# EAGLE design badge (EAGLE 7.4.0)
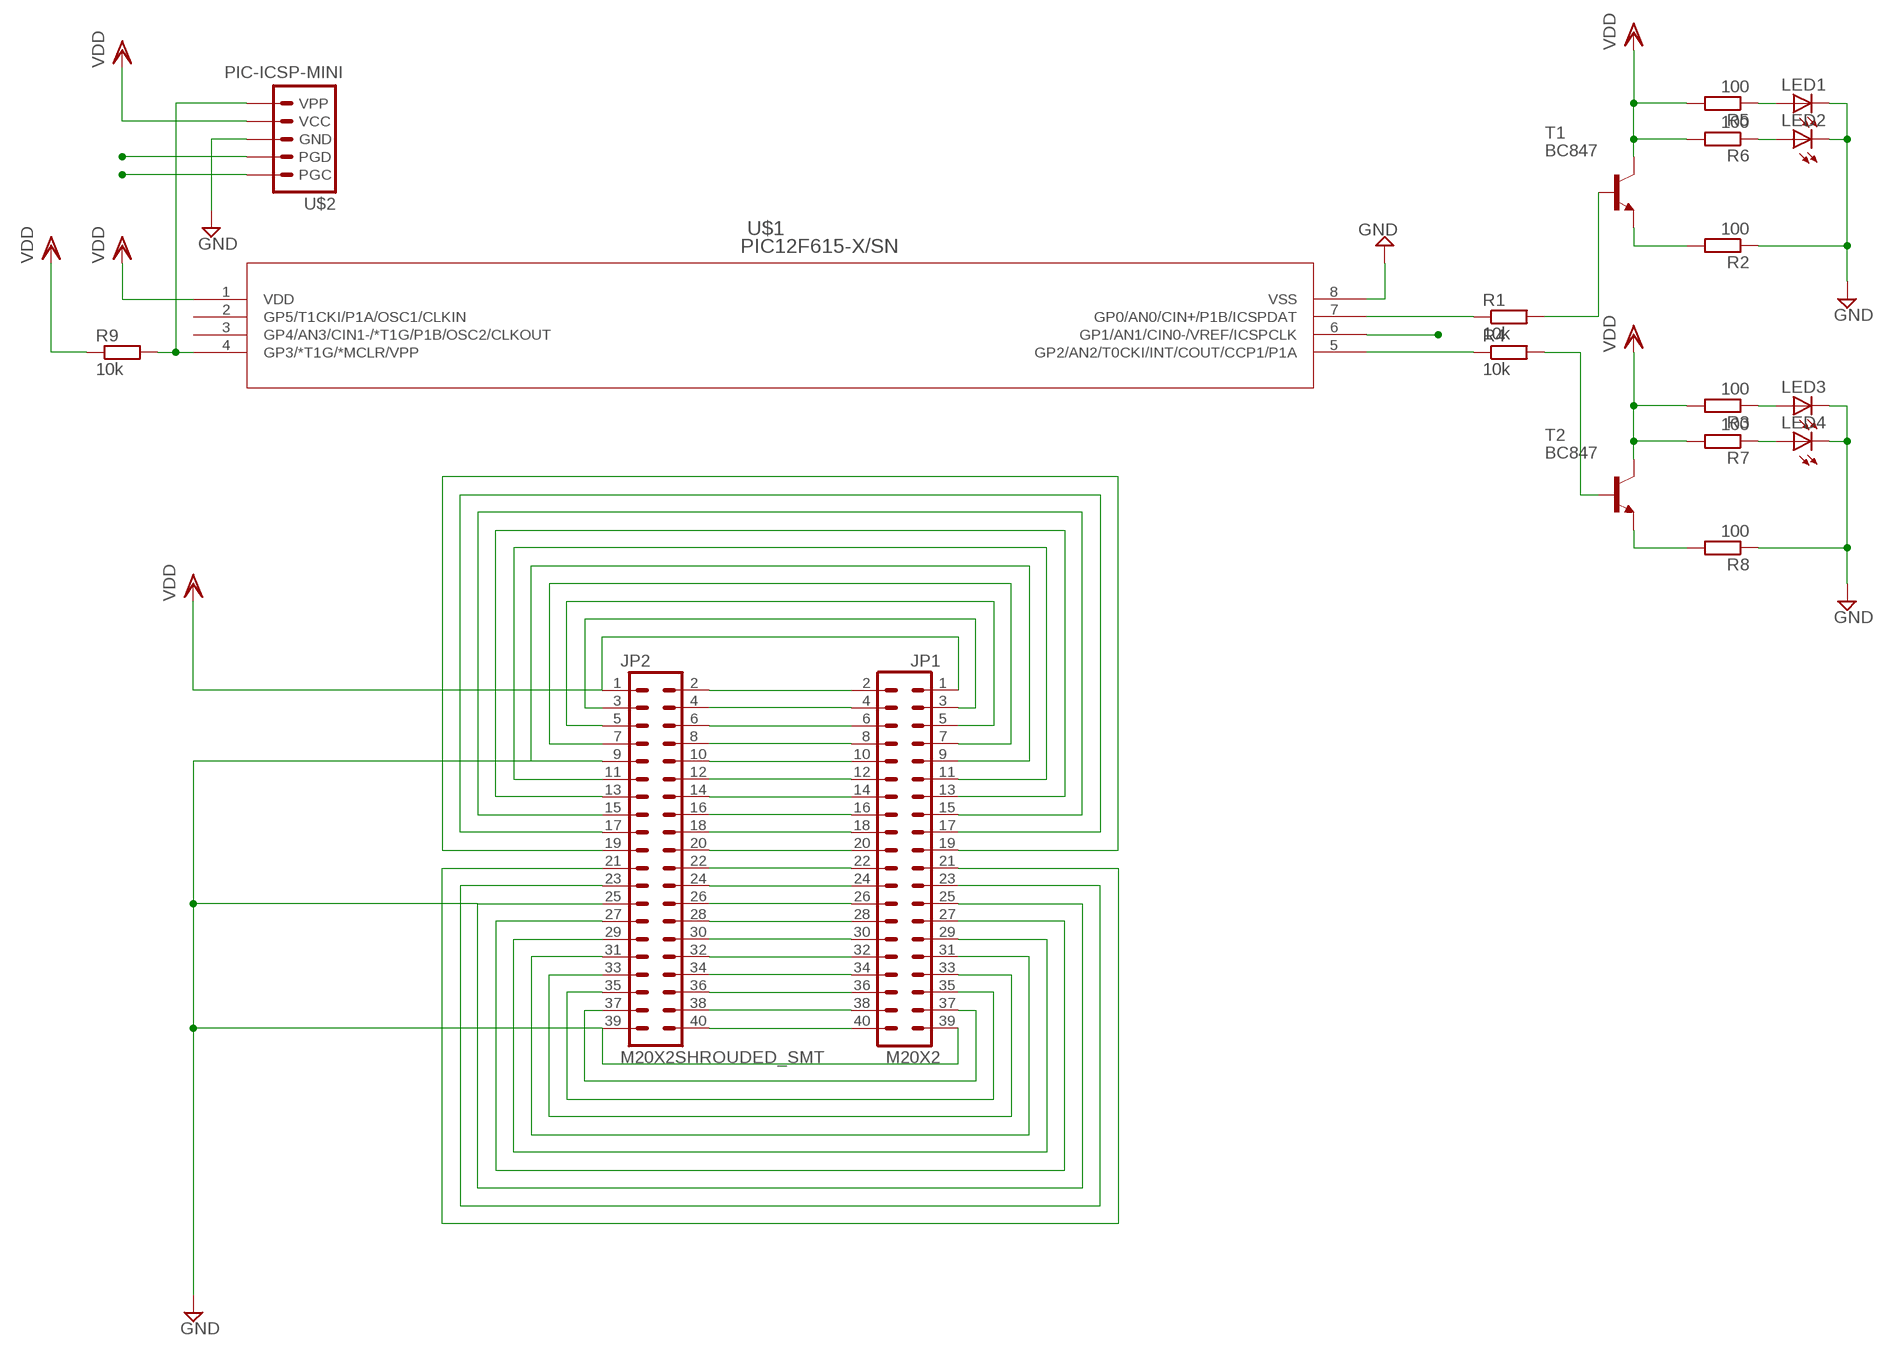
[diagram p0: schematic, sheet 1]

## Parts
JP1  M20X2  [2X20]
JP2  M20X2SHROUDED_SMT  [2X20_SHROUDED_SMT]
LED1  LEDCHIPLED_0805  [CHIPLED_0805]
LED2  LEDCHIPLED_0805  [CHIPLED_0805]
LED3  LEDCHIPLED_0805  [CHIPLED_0805]
LED4  LEDCHIPLED_0805  [CHIPLED_0805]
R1  10k  R-EU_R0805  [R0805]
R2  100  R-EU_R0805  [R0805]
R3  100  R-EU_R0805  [R0805]
R4  10k  R-EU_R0805  [R0805]
R5  100  R-EU_R0805  [R0805]
R6  100  R-EU_R0805  [R0805]
R7  100  R-EU_R0805  [R0805]
R8  100  R-EU_R0805  [R0805]
R9  10k  R-EU_R0805  [R0805]
T1  BC847  [SOT23]
T2  BC847  [SOT23]
U$1  PIC12F615-X/SN  [SOIC8-N_MC]
U$2  PIC-ICSP-MINI  [PIC-ICSP-MINI]

## Nets
GND: JP1.6 JP1.9 JP1.14 JP1.20 JP1.25 JP1.30 JP1.34 JP1.39 JP2.6 JP2.9 JP2.14 JP2.20 JP2.25 JP2.30 JP2.34 JP2.39 LED1.C LED2.C LED3.C LED4.C R2.1 R8.1 U$1.8(VSS) U$2.3(GND)
ICSPCLK: U$1.6(GP1/AN1/CIN0-/VREF/ICSPCLK) U$2.5(PGC)
ICSPDAT: R1.1 U$1.7(GP0/AN0/CIN+/P1B/ICSPDAT) U$2.4(PGD)
N$1: R4.1 U$1.5(GP2/AN2/T0CKI/INT/COUT/CCP1/P1A)
N$2: R9.2 U$1.4(GP3/*T1G/*MCLR/VPP) U$2.1(VPP)
N$3: R4.2 T2.1(B)
N$4: LED1.A R5.1
N$5: R2.2 T1.2(E)
N$6: R1.2 T1.1(B)
N$7: LED2.A R6.1
N$8: LED3.A R3.1
N$9: LED4.A R7.1
N$10: R8.2 T2.2(E)
N$11: JP1.2 JP2.2
N$12: JP1.4 JP2.4
N$14: JP1.8 JP2.8
N$15: JP1.10 JP2.10
N$16: JP1.12 JP2.12
N$18: JP1.16 JP2.16
N$19: JP1.18 JP2.18
N$21: JP1.22 JP2.22
N$22: JP1.24 JP2.24
N$23: JP1.26 JP2.26
N$24: JP1.28 JP2.28
N$26: JP1.32 JP2.32
N$28: JP1.36 JP2.36
N$29: JP1.38 JP2.38
N$30: JP1.40 JP2.40
N$32: JP1.3 JP2.3
N$33: JP1.5 JP2.5
N$34: JP1.7 JP2.7
N$36: JP1.11 JP2.11
N$37: JP1.13 JP2.13
N$38: JP1.15 JP2.15
N$39: JP1.17 JP2.17
N$40: JP1.19 JP2.19
N$42: JP1.37 JP2.37
N$43: JP1.35 JP2.35
N$44: JP1.33 JP2.33
N$45: JP1.31 JP2.31
N$46: JP1.29 JP2.29
N$47: JP1.27 JP2.27
N$49: JP1.23 JP2.23
N$50: JP1.21 JP2.21
VDD: JP1.1 JP2.1 R3.2 R5.2 R6.2 R7.2 R9.1 T1.3(C) T2.3(C) U$1.1(VDD) U$2.2(VCC)
Unconnected: U$1.2(GP5/T1CKI/P1A/OSC1/CLKIN) U$1.3(GP4/AN3/CIN1-/*T1G/P1B/OSC2/CLKOUT)

## Library data of the parts
JP1 JP2 = SparkFun-Connectors:M20X2: 0.1" spaced headers
LED1-LED4 = led:LED: LED OSRAM: - CHIPLED LG R971, LG N971, LY N971, LG Q971, LY Q971, LO R971, LY R971 LH N974, LH R974 LS Q976, LO Q976, LY Q976 LO Q996 - Hyper CHIPLED LW Q18S LB Q993, LB Q99A, LB R99A - SideLED LS A670, LO A670, LY A670, LG A670, LP A670 LB A673, LV A673, LT A673, LW A673 LH A674 LY A675 LS A676, LA A676, LO A676, LY A676, LW A676 LS A679, LY A679, LG A679 - Hyper Micro SIDELED® LS Y876, LA Y876, LO Y876, LY Y876 LT Y87S - SmartLED LW L88C, LW L88S LB L89C, LB L89S, LG L890 LS L89K, LO L89K, LY L89K LS L896, LA L896, LO L896, LY L896 - TOPLED LS T670, LO T670, LY T670, LG T670, LP T670 LSG T670, LSP T670, LSY T670, LOP T670, LYG T670 LG T671, LOG T671, LSG T671 LB T673, LV T673, LT T673, LW T673 LH T674 LS T676, LA T676, LO T676, LY T676, LB T676, LH T676, LSB T676, LW T676 LB T67C, LV T67C, LT T67C, LS T67K, LO T67K, LY T67K, LW E67C LS E67B, LA E67B, LO E67B, LY E67B, LB E67C, LV E67C, LT E67C LW T67C LS T679, LY T679, LG T679 LS T770, LO T770, LY T770, LG T770, LP T770 LB T773, LV T773, LT T773, LW T773 LH T774 LS E675, LA E675, LY E675, LS T675 LS T776, LA T776, LO T776, LY T776, LB T776 LHGB T686 LT T68C, LB T68C - Hyper Mini TOPLED® LB M676 - Mini TOPLED Santana® LG M470 LS M47K, LO M47K, LY M47K Source: http://www.osram.convergy.de LUXEON: - LUMILED® LXK2-PW12-R00, LXK2-PW12-S00, LXK2-PW14-U00, LXK2-PW14-V00 LXK2-PM12-R00, LXK2-PM12-S00, LXK2-PM14-U00 LXK2-PE12-Q00, LXK2-PE12-R00, LXK2-PE12-S00, LXK2-PE14-T00, LXK2-PE14-U00 LXK2-PB12-K00, LXK2-PB12-L00, LXK2-PB12-M00, LXK2-PB14-N00, LXK2-PB14-P00, LXK2-PB14-Q00 LXK2-PR12-L00, LXK2-PR12-M00, LXK2-PR14-Q00, LXK2-PR14-R00 LXK2-PD12-Q00, LXK2-PD12-R00, LXK2-PD12-S00 LXK2-PH12-R00, LXK2-PH12-S00 LXK2-PL12-P00, LXK2-PL12-Q00, LXK2-PL12-R00 Source: www.luxeon.com KINGBRIGHT: KA-3528ASYC Source: www.kingbright.com
R1-R9 = rcl:R-EU_: RESISTOR, European symbol
T1 T2 = transistor:BC847: NPN TRANSISTOR
U$1 = pic12f615:PIC12F615-X/SN
U$2 = SparkFun-Connectors:PIC-ICSP-MINI: PIC-ICSP-Mini Miniature 5-pin connection for temporary programming of PICs. Use this device in your design to save space. Program the PIC with this adapter Spark Fun Electronics SKU : BOB-00194

## Board
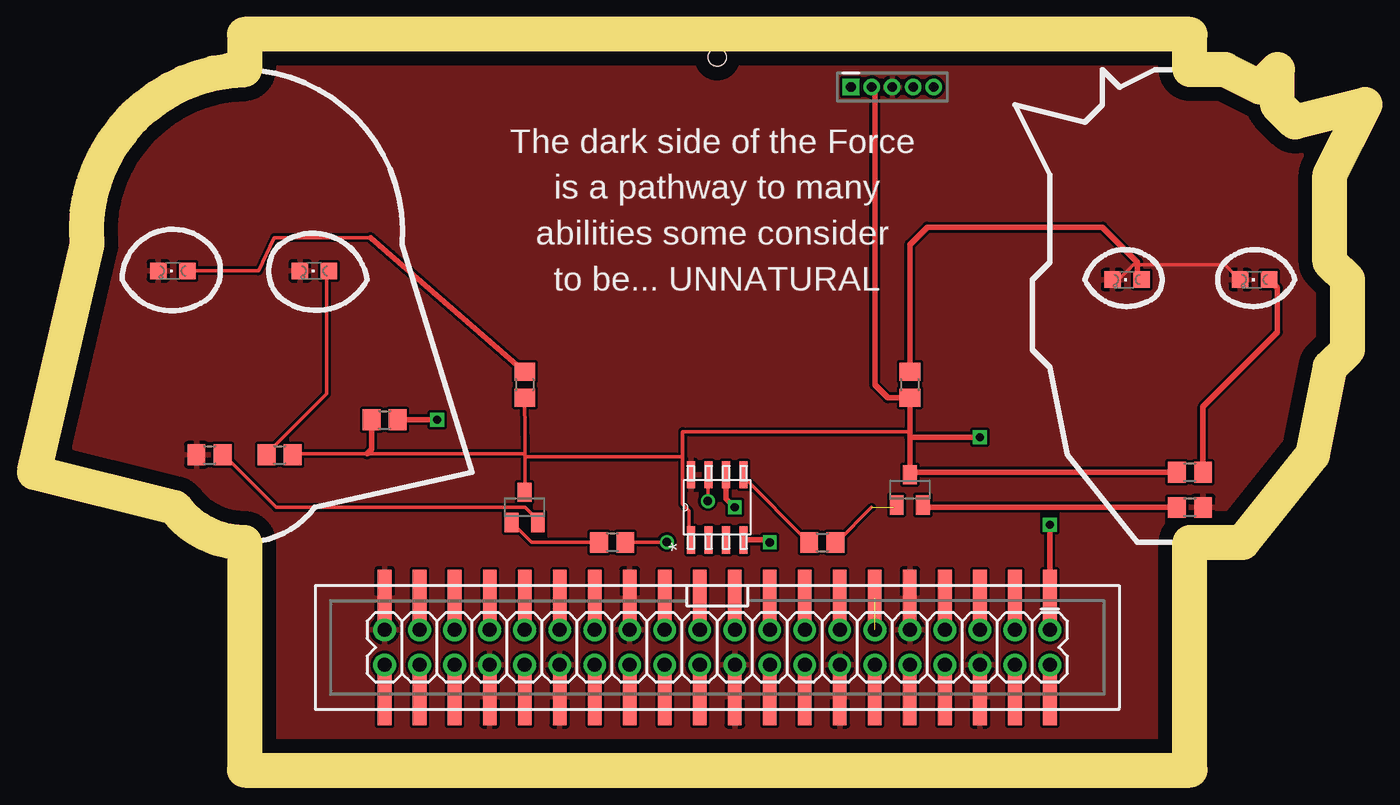
[diagram p1: board, top side]
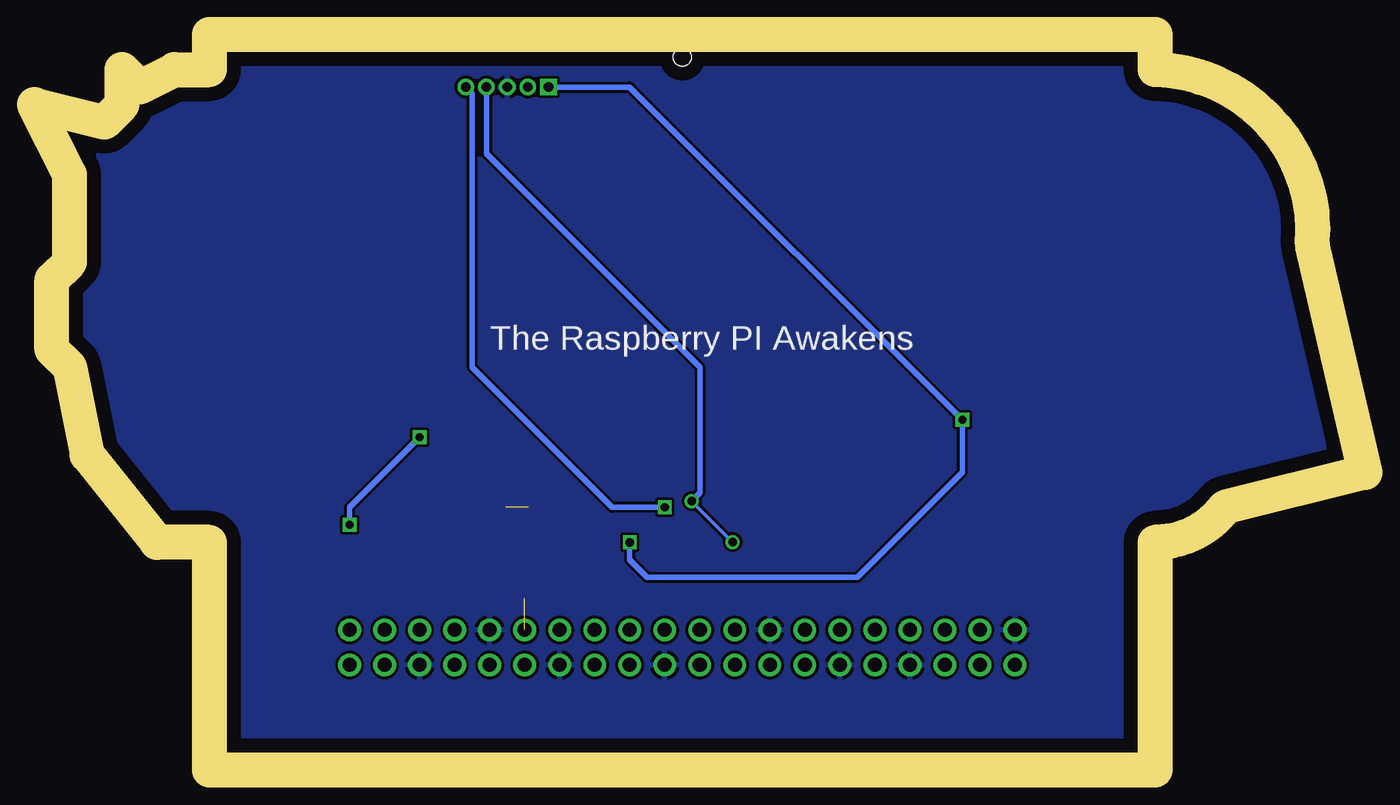
[diagram p2: board, bottom side, seen from below]

Size 96.52 x 53.34 mm. Coordinates in mm from the lower left corner, seen from the top.
Outline: 0,21.59 10.16,19.05 arc53 15.24,16.51 15.24,0 83.82,0 83.82,16.51 87.63,16.51 92.71,22.86 93.98,29.21 95.25,30.48 95.25,35.56 93.98,36.83 93.98,43.18 96.52,48.26 91.44,46.99 90.17,48.26 90.17,50.8 88.9,49.53 86.36,50.8 83.82,50.8 83.82,53.34 15.24,53.34 15.24,50.8 arc93 3.81,38.1 0,21.59
Copper layers (1*16): Top 0.035mm / dielectric 1.5mm / Bottom 0.035mm
Design rules "default": minimum track width 10mil, minimum drill 24mil, track to track 8mil, track to pad 8mil, pad to pad 8mil, via to via 8mil, smd to smd 8mil, copper to edge 40mil, drill to drill 8mil, minimum pad ring 10mil, minimum via ring 8mil, stop-mask expansion 4mil, vias tented up to drill 0mil, thermal gap 10mil
Holes 1.3 mm at 49.53,51.69

### Footprints (pad centres in the part's own frame; a part is rotated, then mirrored left to right if it is on the bottom)
2X20 = drill 1.016 pad 1.651: 1 -24.13,-1.27; 2 -24.13,1.27; 3 -21.59,-1.27; 4 -21.59,1.27; 5 -19.05,-1.27; 6 -19.05,1.27; 7 -16.51,-1.27; 8 -16.51,1.27; 9 -13.97,-1.27; 10 -13.97,1.27; 11 -11.43,-1.27; 12 -11.43,1.27; 13 -8.89,-1.27; 14 -8.89,1.27; 15 -6.35,-1.27; 16 -6.35,1.27; 17 -3.81,-1.27; 18 -3.81,1.27; 19 -1.27,-1.27; 20 -1.27,1.27; 21 1.27,-1.27; 22 1.27,1.27; 23 3.81,-1.27; 24 3.81,1.27; 25 6.35,-1.27; 26 6.35,1.27; 27 8.89,-1.27; 28 8.89,1.27; 29 11.43,-1.27; 30 11.43,1.27; 31 13.97,-1.27; 32 13.97,1.27; 33 16.51,-1.27; 34 16.51,1.27; 35 19.05,-1.27; 36 19.05,1.27; 37 21.59,-1.27; 38 21.59,1.27; 39 24.13,-1.27; 40 24.13,1.27
2X20_SHROUDED_SMT = smd 4.14 x 0.991: 1 -3.569,24.13; 2 3.569,24.13; 3 -3.569,21.59; 4 3.569,21.59; 5 -3.569,19.05; 6 3.569,19.05; 7 -3.569,16.51; 8 3.569,16.51; 9 -3.569,13.97; 10 3.569,13.97; 11 -3.569,11.43; 12 3.569,11.43; 13 -3.569,8.89; 14 3.569,8.89; 15 -3.569,6.35; 16 3.569,6.35; 17 -3.569,3.81; 18 3.569,3.81; 19 -3.569,1.27; 20 3.569,1.27; 21 -3.569,-1.27; 22 3.569,-1.27; 23 -3.569,-3.81; 24 3.569,-3.81; 25 -3.569,-6.35; 26 3.569,-6.35; 27 -3.569,-8.89; 28 3.569,-8.89; 29 -3.569,-11.43; 30 3.569,-11.43; 31 -3.569,-13.97; 32 3.569,-13.97; 33 -3.569,-16.51; 34 3.569,-16.51; 35 -3.569,-19.05; 36 3.569,-19.05; 37 -3.569,-21.59; 38 3.569,-21.59; 39 -3.569,-24.13; 40 3.569,-24.13
CHIPLED_0805 = smd 1.2 x 1.2: A 0,-1.05; C 0,1.05
R0805 = smd 1.3 x 1.5: 1 -0.95,0; 2 0.95,0
SOT23 = smd 1 x 1.4: 1 -0.95,-1.1; 2 0.95,-1.1; 3 0,1.1
SOIC8-N_MC = smd 1.981 x 0.559: 1 -2.362,1.905; 2 -2.362,0.635; 3 -2.362,-0.635; 4 -2.362,-1.905; 5 2.362,-1.905; 6 2.362,-0.635; 7 2.362,0.635; 8 2.362,1.905
PIC-ICSP-MINI = drill 0.7 square: 1 -3,0 | drill 0.7: 2 -1.5,0; 3 0,0; 4 1.5,0; 5 3,0

### Placement (x,y rotation side)
JP1  49.53,8.89 180 top
JP2  49.53,8.89 270 top
LED1  10.03,36.2 90 top
LED2  20.32,36.2 90 top
LED3  79.25,35.56 90 top
LED4  88.52,35.56 90 top
R1  41.91,16.51 180 top
R2  12.7,22.86 0 top
R3  63.5,27.94 270 top
R4  57.15,16.51 0 top
R5  35.56,27.94 270 top
R6  17.78,22.86 0 top
R7  83.82,21.59 180 top
R8  83.82,19.05 180 top
R9  25.4,25.4 0 top
T1  35.56,19.05 0 top
T2  63.5,20.32 0 top
U$1  49.53,19.05 90 top
U$2  62.23,49.53 0 top

### Tracks (layer width: path | path; a pad name or v marks a point on that pad's centre or on a via)
GND
  Top 0.254: LED3.C 78.33,35.74 78.79,35.74 79.7,36.65 86.33,36.65 87.25,35.74 LED4.C
  Top 0.406: JP2.6 JP1.6 | JP2.14 JP1.14 | JP2.20 JP1.20 | JP2.30 JP1.30 | JP2.34 JP1.34
  pour Top: 15.24,-1.27 96.52,-1.27 96.52,54.61 0,54.61 0,-1.27
  pour Bottom: 0,-1.27 96.52,-1.27 96.52,54.61 0,54.61
ICSPCLK  (via drill 0.6)
  Top 0.406: U$1.6 50.16,19.68 v50.8,19.05
  Bottom 0.406: v50.8,19.05 54.61,19.05 64.77,29.21 64.77,49.07 U$2.5
ICSPDAT  (via drill 0.61)
  Top 0.254: 48.84,20.88 48.84,21.34 U$1.7 48.84,20.88 | v45.87,16.54 42.9,16.54 R1.1 | 48.84,20.88 v48.84,19.51
  Bottom 0.254: v48.84,19.51 v45.87,16.54
  Bottom 0.406: U$2.4 63.73,44.68 48.26,29.21 48.26,20.09 v48.84,19.51
N$1
  Top 0.254: R4.1 56.16,16.54 51.36,21.34 U$1.5
N$2  (via drill 0.6)
  Top 0.406: U$1.4 53.16,16.69 v53.34,16.51 | v29.21,25.4 R9.2
  Bottom 0.406: v53.34,16.51 53.34,15.24 52.07,13.97 36.83,13.97 29.21,21.59 v29.21,25.4 53.34,49.53 U$2.1
N$3  (1 unrouted)
  Top 0.254: 60.73,19.05 58.22,16.54 R4.2 | 62.33,19.05 T2.1
N$4
  Top 0.254: LED1.A 16.26,36.2 17.4,38.61 24.38,38.61
  Top 0.406: 24.38,38.61 25.84,37.34 R5.1
N$5
  Top 0.254: T1.2 36.5,18.14 35.59,19.05 17.53,19.05 13.87,22.71 R2.2
N$6
  Top 0.254: T1.1 34.67,17.91 36.04,16.54 40.84,16.54 R1.2
N$7
  Top 0.254: LED2.A 21.18,36.2 21.18,27.28 16.84,22.94 R6.1
N$8
  Top 0.406: R3.1 63.5,38.1 64.77,39.37 77.47,39.37 80.01,36.83 80.01,35.85 LED3.A
N$9
  Top 0.406: R7.1 84.77,26.35 90.17,31.75 90.17,34.96 LED4.A
N$10
  Top 0.406: R8.2 64.62,19.05 T2.2
N$11
  Top 0.406: JP2.2 JP1.2
N$12
  Top 0.406: JP2.4 JP1.4
N$14
  Top 0.406: JP2.8 JP1.8
N$15
  Top 0.406: JP2.10 JP1.10
N$16
  Top 0.406: JP2.12 JP1.12
N$18
  Top 0.406: JP2.16 JP1.16
N$19
  Top 0.406: JP2.18 JP1.18
N$21
  Top 0.406: JP2.22 JP1.22
N$22
  Top 0.406: JP2.24 JP1.24
N$23
  Top 0.406: JP2.26 JP1.26
N$24
  Top 0.406: JP2.28 JP1.28
N$26
  Top 0.406: JP2.32 JP1.32
N$28
  Top 0.406: JP2.36 JP1.36
N$29
  Top 0.406: JP2.38 JP1.38
N$30
  Top 0.406: JP2.40 JP1.40
N$32
  Top 0.406: JP2.3 JP1.3
N$33
  Top 0.406: JP2.5 JP1.5
N$34
  Top 0.406: JP2.7 JP1.7
N$36  (1 unrouted)
N$37
  Top 0.406: JP2.13 JP1.13
N$38
  Top 0.406: JP2.15 JP1.15
N$39
  Top 0.406: JP2.17 JP1.17
N$40
  Top 0.406: JP2.19 JP1.19
N$42
  Top 0.406: JP2.37 JP1.37
N$43
  Top 0.406: JP2.35 JP1.35
N$44
  Top 0.406: JP2.33 JP1.33
N$45
  Top 0.406: JP2.31 JP1.31
N$46
  Top 0.406: JP2.29 JP1.29
N$47
  Top 0.406: JP2.27 JP1.27
N$49
  Top 0.406: JP2.23 JP1.23
N$50
  Top 0.406: JP2.21 JP1.21
VDD  (via drill 0.6)
  Top 0.254: 47.02,22.71 47.02,24.54 63.48,24.54 R3.2 | 47.02,22.71 47.02,19.28 47.47,18.82 47.47,16.76 U$1.1 | 35.59,22.94 35.59,24.31 R5.2 | 35.59,22.94 35.59,22.71 | 35.59,22.71 35.59,20.19 T1.3 | 35.59,22.94 24.13,22.94 18.9,22.94 R6.2 | 35.59,22.71 47.02,22.71
  Top 0.406: R7.2 63.67,21.59 T2.3 63.5,24.13 | 63.5,24.13 R3.2 61.91,26.99 60.96,27.94 60.96,49.3 U$2.2 | R9.1 24.45,23.26 24.13,22.94 | JP1.1 JP2.1 v73.66,17.78 | v68.58,24.13 63.5,24.13
  Bottom 0.406: v73.66,17.78 73.66,19.05 v68.58,24.13

### Text on the board
tPlace: The dark side of the Force / is a pathway to many / abilities some consider / to be... UNNATURAL
bPlace: The Raspberry PI Awakens